# Altium schematic sheet FPGA Configuration.SchDoc
size A3; SheetNumber: 5; SheetTotal: 16
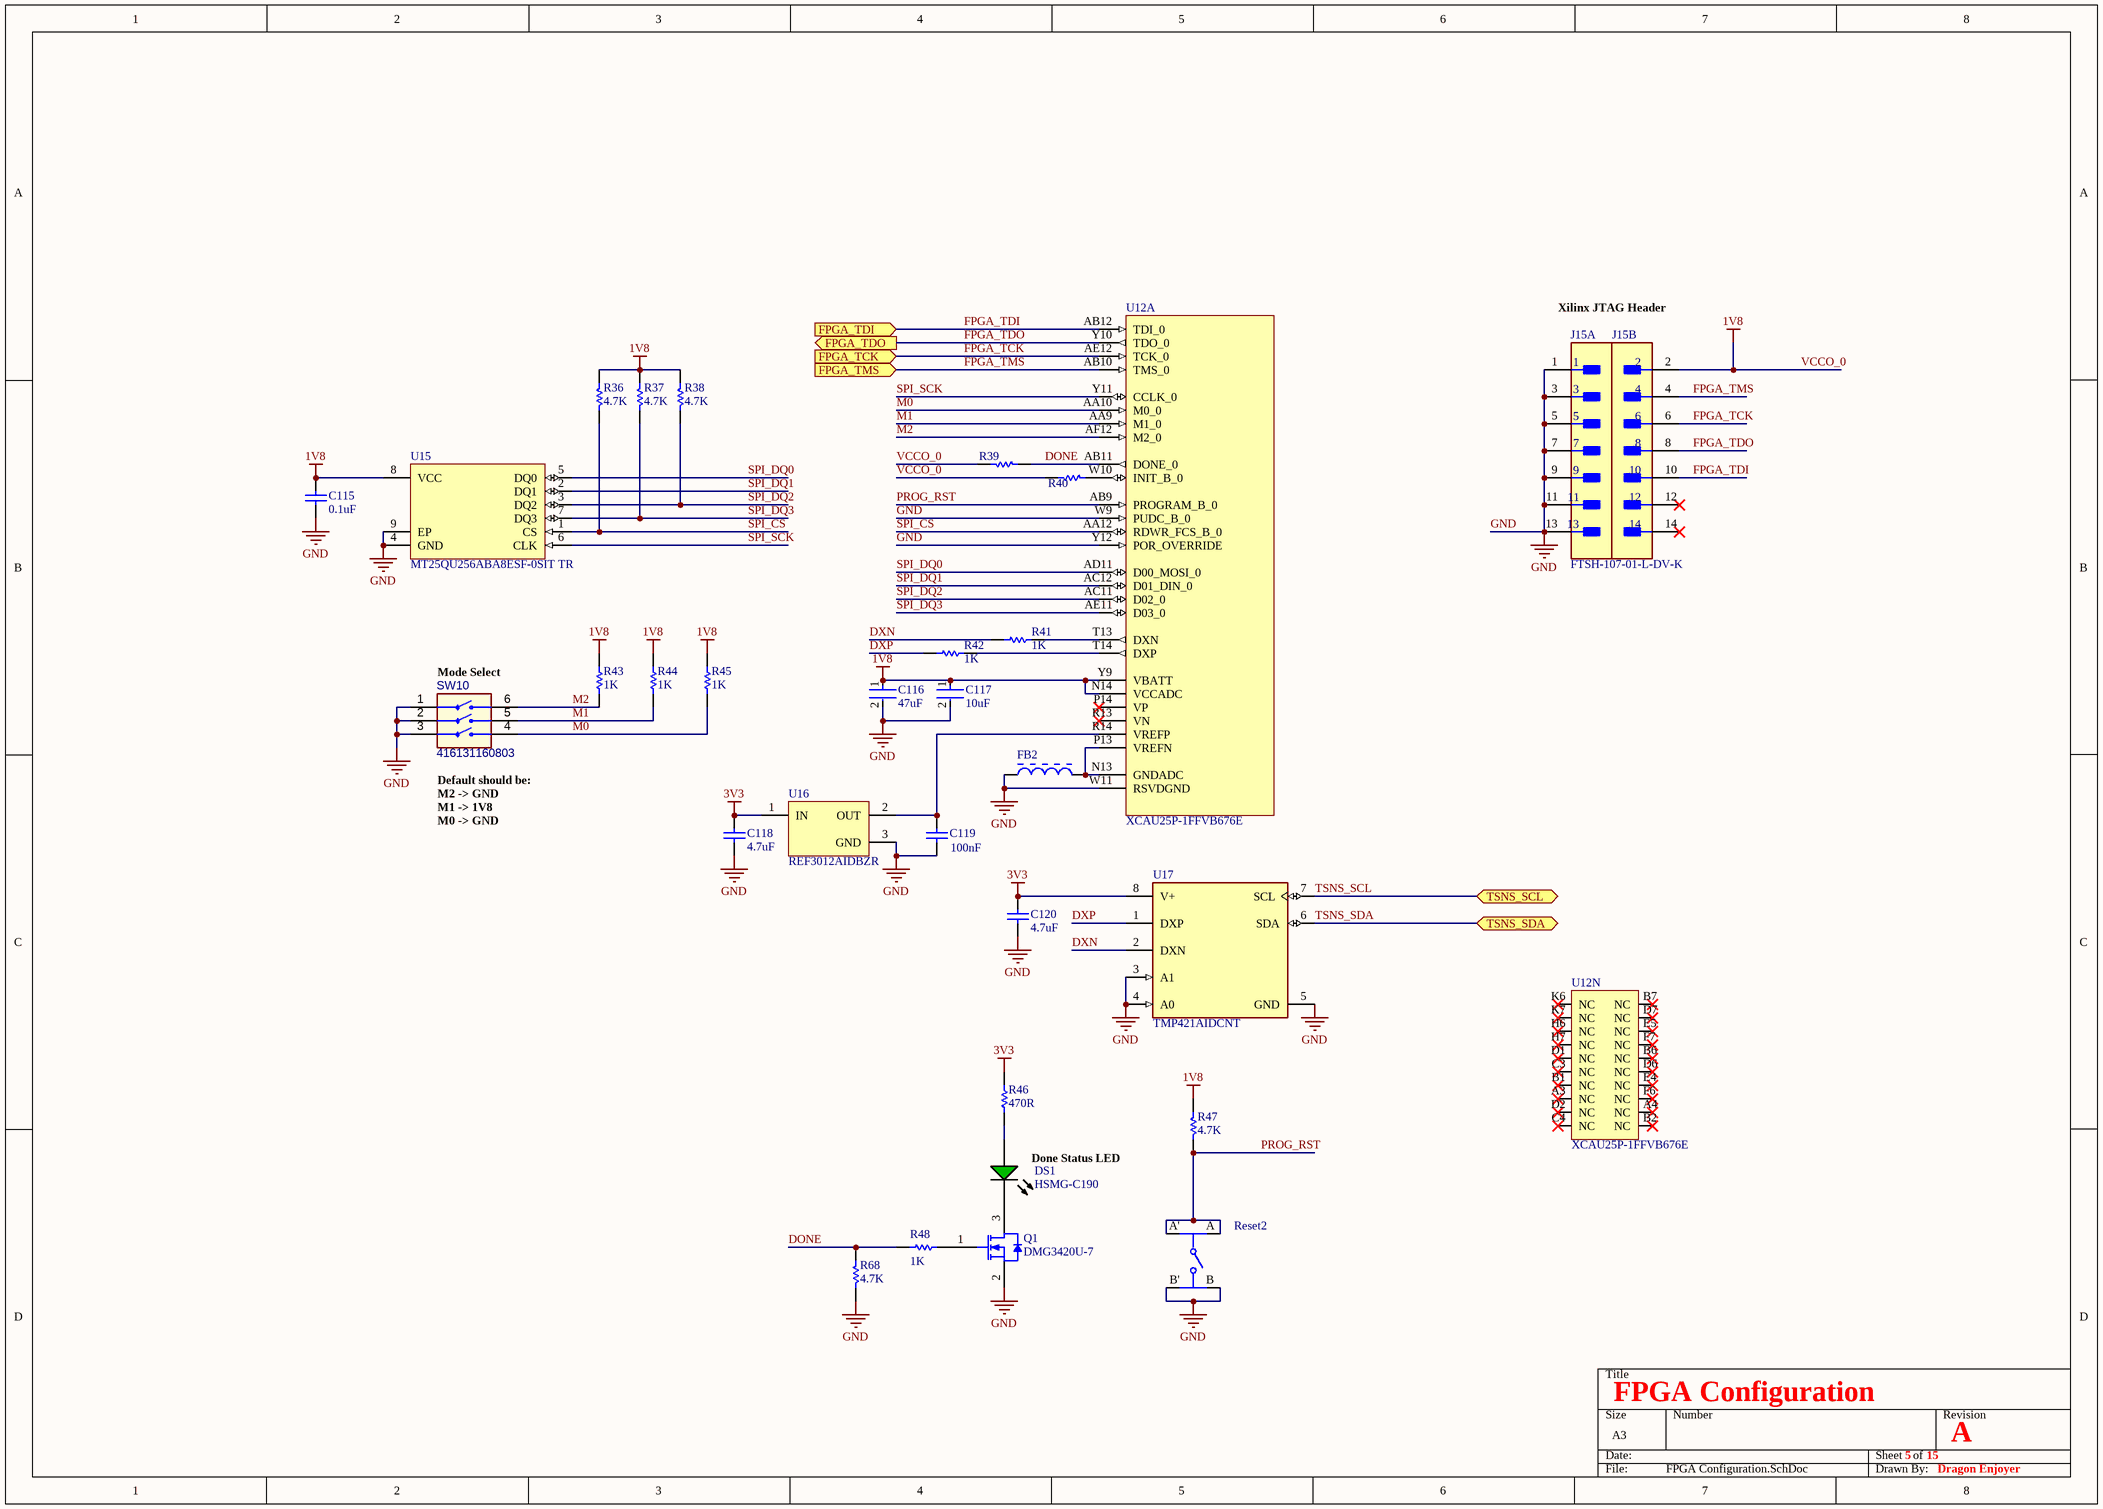
[diagram p0: FPGA Configuration.SchDoc]

## Parts
C115  value 0.1uF  [CAPC1005X56X25LL10T15]  (hidden comment: 04026D104KAT2A)
C116  Capacitance: 47uF  [FP-GRM188-0_2-IPC_C]  (hidden comment: GRM188C80E476ME05D)
C117  Capacitance: 10uF  [FP-GRM15-0_2-MFG]  (hidden comment: GRM155C80J106ME11D)
C118  value 4.7uF  [CAPC2013X135X45NL10T25]  (hidden comment: GRM21BR61E475KA12L)
C119  Capacitance: 100nF  [CAPC1608X90X35ML10T15]  (hidden comment: GRM188R71H104KA93D)
C120  value 4.7uF  [CAPC2013X135X45NL10T25]  (hidden comment: GRM21BR61E475KA12L)
DS1  HSMG-C190  [AVAG-HSMX-C190_V]
FB2  BLM15AG100SN1D  [MURA-BLM15-CHIP-2_V]  (value not drawn)
J15  FTSH-107-01-L-DV-K  [FP-FTSH-107-01-L-DV-K-MFG]  (parts A,B of 2)
Q1  DMG3420U-7  [DIOD-SOT23-3_B_V]
R36  value 4.7K  [RESC1005X40X25LL05T10]  (hidden comment: RC0402JR-074K7L)
R37  value 4.7K  [RESC1005X40X25LL05T10]  (hidden comment: RC0402JR-074K7L)
R38  value 4.7K  [RESC1005X40X25LL05T10]  (hidden comment: RC0402JR-074K7L)
R39  RC0402JR-074K7L  [RESC1005X40X25LL05T10]  (value not drawn)
R40  RC0402JR-074K7L  [RESC1005X40X25LL05T10]  (value not drawn)
R41  value 1K  [RESC1005X40X25NL05T10]  (hidden comment: RC0402FR-071KL)
R42  value 1K  [RESC1005X40X25NL05T10]  (hidden comment: RC0402FR-071KL)
R43  value 1K  [RESC1005X40X25NL05T10]  (hidden comment: RC0402FR-071KL)
R44  value 1K  [RESC1005X40X25NL05T10]  (hidden comment: RC0402FR-071KL)
R45  value 1K  [RESC1005X40X25NL05T10]  (hidden comment: RC0402FR-071KL)
R46  value 470R  [RESC0603X26X15LL03T05]  (hidden comment: ERJ1GNF4700C)
R47  value 4.7K  [RESC1005X40X25LL05T10]  (hidden comment: RC0402JR-074K7L)
R48  value 1K  [RESC1005X40X25NL05T10]  (hidden comment: RC0402FR-071KL)
R68  value 4.7K  [RESC1005X40X25LL05T10]  (hidden comment: RC0402JR-074K7L)
Reset2  EVQ-Q2U03W  [FP-EVQQ2-MFG]  (value not drawn)
SW10  416131160803  [416131160803]
U12  XCAU25P-1FFVB676E  [BGA676C100P26X26_2600X2600X352]  (parts A,N of 14)
U15  MT25QU256ABA8ESF-0SIT TR  [SON127P800X75_HS-9N]
U16  REF3012AIDBZR  [DBZ0003A_M]
U17  TMP421AIDCNT  [FP-DCN0008A-IPC_C]

## Ports
FPGA_TCK (in), FPGA_TDI (in), FPGA_TDO (out), FPGA_TMS (in), TSNS_SCL (bidir), TSNS_SDA (bidir)

## Nets
3V3: C118.1 C120.1 R46.1 U16.1(IN) U17.8(V+)
GND: C115.1 C116.2 C117.2 C118.2 C119.1 C120.2 FB2.1 J15.1 J15.3 J15.5 J15.7 J15.9 J15.11 J15.13 Q1.2(S) R68.2 Reset2.B Reset2.B' SW10.1 SW10.2 SW10.3 U12.W9(PUDC_B_0) U12.W11(RSVDGND) U12.Y12(POR_OVERRIDE) U15.4(GND) U15.9(EP) U16.3(GND) U17.3(A1) U17.4(A0) U17.5(GND)
VCCO_0: C115.2 C116.1 C117.1 J15.2 R36.1 R37.1 R38.1 R39.2 R40.2 R43.2 R44.2 R45.1 R47.1 U12.N14(VCCADC) U12.Y9(VBATT) U15.8(VCC)  [also labelled 1V8]
DONE: R39.1 R48.1 R68.1 U12.AB11(DONE_0)
DXN: R41.1 U17.2(DXN)
DXP: R42.1 U17.1(DXP)
FPGA_TCK: J15.6 U12.AE12(TCK_0) ; port FPGA_TCK
FPGA_TDI: J15.10 U12.AB12(TDI_0) ; port FPGA_TDI
FPGA_TDO: J15.8 U12.Y10(TDO_0) ; port FPGA_TDO
FPGA_TMS: J15.4 U12.AB10(TMS_0) ; port FPGA_TMS
M0: R45.2 SW10.4 U12.AA10(M0_0)
M1: R44.1 SW10.5 U12.AA9(M1_0)
M2: R43.1 SW10.6 U12.AF12(M2_0)
PROG_RST: R47.2 Reset2.A Reset2.A' U12.AB9(PROGRAM_B_0)
SPI_CS: R36.2 U12.AA12(RDWR_FCS_B_0) U15.1(CS)
SPI_DQ0: U12.AD11(D00_MOSI_0) U15.5(DQ0)
SPI_DQ1: U12.AC12(D01_DIN_0) U15.2(DQ1)
SPI_DQ2: R38.2 U12.AC11(D02_0) U15.3(DQ2)
SPI_DQ3: R37.2 U12.AE11(D03_0) U15.7(DQ3)
SPI_SCK: U12.Y11(CCLK_0) U15.6(CLK)
TSNS_SCL: U17.7(SCL) ; port TSNS_SCL
TSNS_SDA: U17.6(SDA) ; port TSNS_SDA
NetC119_2: C119.2 U12.R14(VREFP) U16.2(OUT)
NetDS1_1: DS1.1(A) R46.2
NetDS1_2: DS1.2(K) Q1.3(D)
NetFB2_2: FB2.2 U12.N13(GNDADC) U12.P13(VREFN)
NetQ1_1: Q1.1(G) R48.2
NetR40_1: R40.1 U12.W10(INIT_B_0)
NetR41_2: R41.2 U12.T13(DXN)
NetR42_2: R42.2 U12.T14(DXP)

Not connected (* = marked no-connect by the designer): J15 12* 14*; U12 A3(NC)* A4(NC)* B1(NC)* B2(NC)* B6(NC)* B7(NC)* C3(NC)* C4(NC)* D1(NC)* D2(NC)* D6(NC)* D7(NC)* E4(NC)* E5(NC)* F6(NC)* F7(NC)* H6(NC)* H7(NC)* K6(NC)* K7(NC)* P14(VP)* R13(VN)*

## Notes on the sheet
- Xilinx JTAG Header
- (near SW10) Mode Select
- (near SW10) Default should be:
- M2 -> GND
- M1 -> 1V8
- M0 -> GND
- (near DS1) Done Status LED
- FPGA Configuration
- 5
- 15
- A
- Dragon Enjoyer

## Library data of the parts
C115 = CMP-2008-02743-1: Manufacturer: AVX Interconnect / Elco; Part Number: 04026D104KAT2A
C116 = CMP-06035-059951-1: Chip Multilayer Ceramic Capacitors for General Purpose, 0603, 47uF, X6S, 22%, 20%, 2.5V; Min Operating Temperature: -55°C; Length: 0.063inch; Thickness: 0.039inch; Tolerance: 20%; Width: 0.031inch; Case Code (Metric): 1608; Voltage Rating: 2.5V; Voltage Rating (DC): 2.5V; Case Code (Imperial): 0603; Dielectric: X6S; Mount: Surface Mount; Case/Package: 0603; Max Operating Temperature: 105°C; Packaging: Tape and Reel
C117 = CMP-06035-000074-1: CAP CER 10UF 6.3V X6S 0402; Manufacturer: Murata; Tolerance: 20%; Material: Ceramic; Temperature Coefficient: 22%; ComponentLink2Description: Datasheet; Temperature Characteristic: X6S; RoHS: TRUE; Value: 10uF; Temperature: -55°C to +105°C; Device Class L2: Capacitors; Height: 0.7mm; Category: Cap; Manufacturer Part Number: GRM155C80J106ME11D; Device Class L1: Passive Components; Temperature Range Low: -55°C; Automotive: No; Mouser Description: Cap Ceramic 10uF 6.3V X6S 20% Pad SMD 0402 105C T/R; ComponentLink2URL: https://search.murata.co.jp/Ceramy/image/img/A01X/G101/ENG/GRM155C80J106ME11-01.pdf; Voltage Rating: 6.3V; Ipc Land Pattern Name: CAPC10050X50; Lead Free: Yes; Octopart: https://octopart.com/grm155c80j106me11d-murata-71220993; Digikey Description: CAP CER 10UF 6.3V X6S 0402; Temperature Range High: +105°C; Package: GRM15-0.2; Device Class L3: Ceramic Capacitors
C118 C120 = CMP-2007-03545-1: Manufacturer: Murata; Part Number: GRM21BR61E475KA12L
C119 = CMP-2100-03643-1: Chip Capacitor, 0.1 uF, +/- 10%, 50 V, -55 to 125 degC, 0603 (1608 Metric), RoHS, Tape and Reel; Manufacturer: Murata; Dielectric Material: Ceramic; Voltage Rating: 50V; Dielectric: X7R; Insulation Resistance: 10GR; Case Code (Metric): 1608; Lead Free: LeadFree; Depth: 0.8mm; Number of Pins: 2; Radiation Hardening: No; Case/Package: 0603; Manufacturer URL: http://www.murata.com/; Packaging: TapeandReel; Length: 1.6mm; Contact Plating: Tin; Datasheet URL: http://psearch.en.murata.com/capacitor/product/GRM188R71H104KA93%23.pdf; Tolerance: 10%; Case Code (Imperial): 0603; Min Operating Temperature: -55degC; RoHSCompliant: true; Voltage: 50V; Termination: SMD/SMT; Mount: SurfaceMount; Material: Ceramic; Package Quantity: 1; Height: 0.8mm; Thickness: 0.035inch; REACH SVHC: NoSVHC; Max Operating Temperature: 125degC; Width: 0.8mm; Package Reference: 0603; Voltage Rating (DC): 50V; Datasheet Version: 42675.0; Package Description: 2-Pin Surface Mount Device, Body 1.6 x 0.8 mm
DS1 = CMP-1744-00002-1: Chip LED, Green, 2.2 V, -40 to 85 degC, 2-Pin SMD, RoHS, Tape and Reel; Frequency: 400 KHz; Max Supply Voltage: 5.5 V; Access Time: 3500 ns; Clock Frequency: 100 KHz; Case\Package: SOIC; Density: 32 kb; Nominal Supply Current: 2 mA; Interface: Serial; Min Supply Voltage: 1.7 V; Packaging: Tape and Reel; PackageReference: HSMX-C190; ComponentLink2URL: http://docs.avagotech.com/docs/AV02-0551EN; RoHSCompliant: true; Pins: 8; REACH SVHC: No SVHC; Max Operating Temperature: 85 degC; Width: 4 mm; Radiation Hardening: No; Package Quantity: 3000; ComponentLink3Description: Package Specification; ComponentLink1Description: Manufacturer URL; Min Operating Temperature: -40 degC; PackageDescription: 2-Pin Surface Mount Device, Body 1.6 x 0.8 mm, Height 0.9 mm; Max Clock Frequency: 100 KHz; Height: 1.5 mm; ComponentLink1URL: http://www.avagotech.com/; DatasheetVersion: Mar-12; ComponentLink2Description: Datasheet; Mount: Surface Mount; Length: 5 mm; ComponentLink3URL: http://www.fairchildsemi.com/dwg/MA/MA03D.pdf
FB2 = CMP-0686-00176-3: Chip Ferrite Bead for General Use, 10 Ohm, 1000 mA, -55 to 125 degC, 1 x 0.5 x 0.55 mm SMD, Tape and Reel; Manufacturer: Murata; Impedance (at 100 MHz): 10 Ohm Typ.; Rated Current: 1000 mA; DC Resistance: 0.025 Ohm Max.; PackageDescription: 2-Pin Chip, Body 1 x 0.5 mm; DatasheetVersion: 08/2013; Mounting Technology: Surface Mount; ComponentLink2URL: http://www.murata.com/products/catalog/pdf/c31e.pdf; Packing: Tape and Reel; ComponentLink1URL: http://www.murata.com/; PartNumber: BLM15AG100SN1D; ComponentLink1Description: Manufacturer URL; Operating Temperature Range: -55 to 125 degC; ComponentLink2Description: Datasheet; ComponentLink3Description: Package Specification; PackageReference: BLM15-2; ComponentLink3URL: http://www.murata.com/products/catalog/pdf/c31e.pdf
J15 = CMP-02766-001412-1: CONN HEADER SMD 14POS 1.27MM; Number of Contacts: 14; Gender: Male; Termination: Solder; Lead Free: Lead Free; Depth: 5.84mm; Min Operating Temperature: -55°C; Length: 8.89mm; RoHS Compliant: Yes; Housing Material: Polymer; Housing Color: Black; Max Operating Temperature: 125°C; Number of Rows: 2; Pitch: 1.27mm; Radiation Hardening: No; Orientation: Straight; Packaging: Rail/Tube; Contact Material: Bronze; Contact Plating: Gold
Q1 = CMP-2000-06172-1: N-Channel Enhancement Mode MOSFET, 20 V, -55 to 150 degC, 3-Pin SOT23, RoHS, Tape and Reel; Manufacturer: Diodes Inc; Drain-Source On Resistance-Max: 29mO; Qg Gate Charge: 5.4nC; Drain-to-Source Voltage [Vdss]: 20V; Rated Power Dissipation: 740mW; Datasheet URL: http://www.diodes.com/_files/datasheets/ds31867.pdf; Package Description: 3-Pin Small Outline Transistor, Body 2.9 x 1.3 mm, Pitch 0.96 mm; Package Reference: SOT23-3; Datasheet Version: Rev. 5-2, 09/2013; Mounting Technology: SurfaceMount; Channel Type: N-Channel; Manufacturer URL: http://www.diodes.com/
R36-R38 R47 R68 = CMP-2002-08011-1: Manufacturer: Yageo / Phycomp; Part Number: RC0402JR-074K7L
R39 R40 = CMP-2002-08011-1: Manufacturer: Yageo / Phycomp; Value: 4.7K; Part Number: RC0402JR-074K7L
R41-R45 R48 = CMP-2002-07472-1: Manufacturer: Yageo / Phycomp; Part Number: RC0402FR-071KL
R46 = CMP-1010-00379-2: Manufacturer: Panasonic; Part Number: ERJ1GNF4700C
Reset2 = CMP-05618-000012-1: SWITCH TACTILE SPST-NO 0.02A 15V; Manufacturer: Panasonic; Contact Current Rating: 20mA; Contact Resistance: 100mΩ; Operating Force: 2.6N; Electromechanical Life: 200000Cycles; Height: 3.3mm; Device Class L3: Tactile Switches; Voltage Rating Dc: 15V; Temperature: -40°C to +85°C; Device Class L1: Electromechanical; Manufacturer Part Number: EVQ-Q2U03W; Mount: Surface Mount; ComponentLink2Description: Datasheet; Automotive: No; Lead Free: Yes; Throw Configuration: SPST-NO; RoHS: TRUE; ComponentLink2URL: https://industrial.panasonic.com/cdbs/www-data/pdf/ATK0000/ATK0000C360.pdf; Package: EVQQ2; Temperature Range High: +85°C; Temperature Range Low: -40°C; Mouser Description: Tactile Switches 2.6NF 6.5x6.0x3.1mm; Digikey Description: SWITCH TACTILE SPST-NO 0.02A 15V; Octopart: https://octopart.com/evq-q2u03w-panasonic-1404553; Category: Switch; Device Class L2: Switches
SW10 = CMP-011-00012-1: WS-DISV 1.27 mm small compact SMD Dip Switch with top tape; ComponentLink2URL: http://katalog.we-online.de/em/datasheet/4161311608xx.pdf; ComponentLink1URL: http://www.we-online.com; ComponentLink1Description: Manufacturer URL; Pins: 6; ComponentLink2Description: Datasheet
U12 = CMP-020-00023-3: FPGA XCAU25 Family 308437 Logic Units 308437 Cells 0.85V 676-Pin FCBGA
U15 = CMP-019-00062-3: NOR Flash 256Mbit 32M X 8bit Serial-SPI 1.8V 5ns/6ns 16-Pin SOP T/R
U16 = CMP-0367-00192-2: 1.25 V, 50 ppm / degC, 50 uA Series (Bandgap) Voltage Reference, -40 to 125 degC, 3-pin SOT-23 (DBZ), Green (RoHS & no Sb/Br); Manufacturer: Texas Instruments; VI(Min)(V): 1.8; Iq(Max)(uA): 50; Rating: Catalog; Temp Coeff(Typ)(ppm/ degree C): 20; VI(Max)(V): 5.5; SubFamily: Series Voltage Reference; VO(V): 1.25; Initial Accuracy @ 25/deg C(%): 0.2; Mounting Technology: Surface Mount; PackageDescription: 3-Pin Plastic Small Outline, Body 2.92 x 1.3 mm, Pitch 0.95 mm; PartNumber: REF3012AIDBZR; ComponentLink3Description: Package Specification; Temp Coeff(Max)(ppm/ degree C): 50; ComponentLink1URL: http://www.ti.com/; PackageVersion: 4203227/B; ComponentLink3URL: http://www.ti.com/litv/pdf/mpds108a; ComponentLink2URL: http://www.ti.com/general/docs/lit/getliterature.tsp?genericPartNumber=REF3012&fileType=pdf; Eco-Plan: Green (RoHS & no Sb/Br); ComponentLink2Description: Datasheet; Code_JEDEC: TO-236; ComponentLink1Description: Manufacturer URL; PackageReference: DBZ0003A; DatasheetVersion: SBVS032F
U17 = CMP-04948-000061-1: SENSOR DIGITAL -40C-125C SOT23-8; Min Supply Voltage (DC): 2.7V; Quiescent Current: 400uA; Output Current: 6mA; Interface: I2C; Max Supply Voltage: 5.5V; Operating Supply Current: 32uA; Resolution: 12b; Number of Bits: 12; Output Voltage: 150mV; Output Type: Digital; Termination: SMD/SMT; Number of Pins: 8; Min Operating Temperature: -40°C; Lead Free: Lead Free; RoHS Compliant: Yes; Min Supply Voltage: 2.7V; Height: 1.1mm; Packaging: Tape and Reel; Mount: Surface Mount; Contact Plating: Gold; Package Quantity: 250; REACH SVHC: No SVHC; Max Supply Voltage (DC): 5.5V; Nominal Supply Current: 400uA; Length: 2.9mm; Radiation Hardening: No; Width: 1.63mm; Max Operating Temperature: 125°C; Case/Package: SOT-23-8